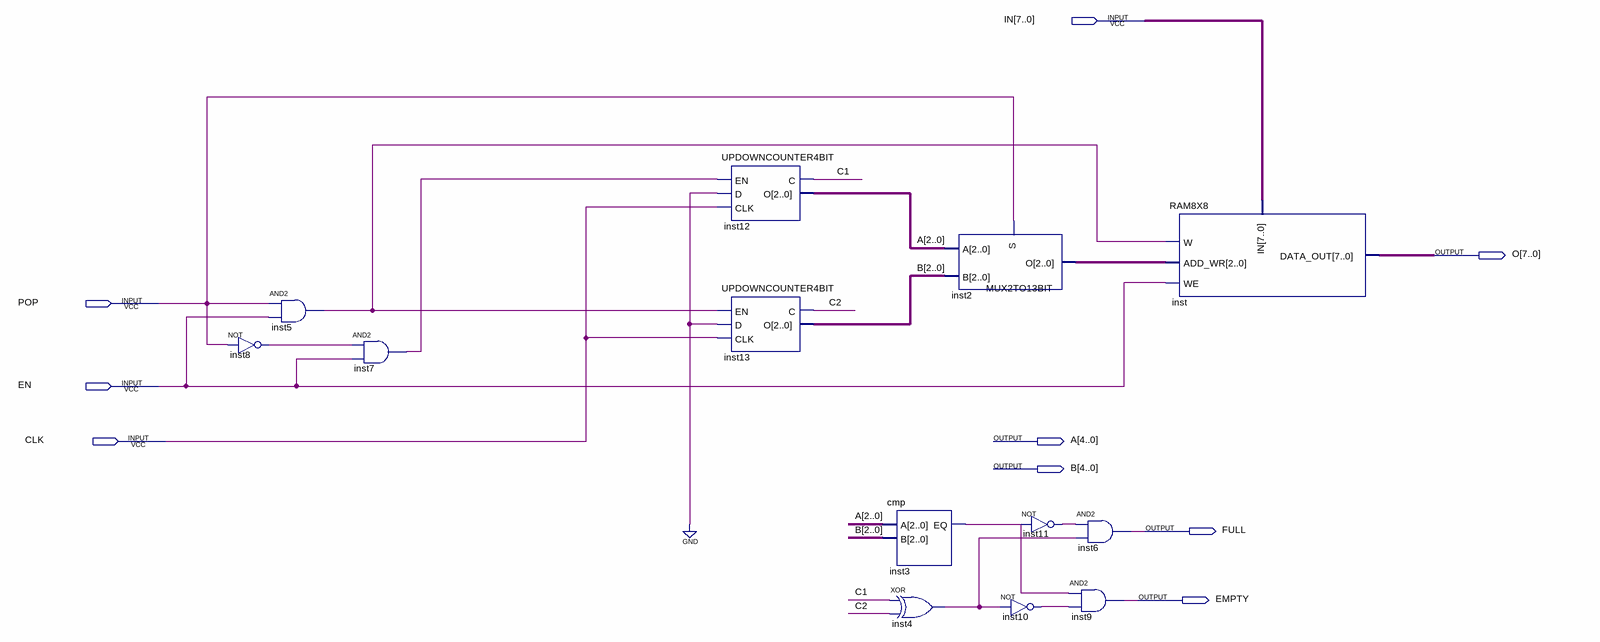
[diagram p0: schematic sheet]
// Quartus schematic QUEUERAM.bdf as structural Verilog: 13 symbols, 9 pins
module QUEUERAM (
  input  [7:0] IN,
  input  POP,
  input  EN,
  input  CLK,
  output [7:0] O,
  output [4:0] A,
  output [4:0] B,
  output FULL,
  output EMPTY
);

  wire C1, C2, inst3_eq, inst4_out, inst5_out, inst7_out, inst8_out, inst10_out, inst11_out;
  wire [2:0] inst2_o;

  not inst8 (inst8_out, POP);
  and inst5 (inst5_out, POP, EN);
  and inst7 (inst7_out, inst8_out, EN);
  UPDOWNCOUNTER4BIT inst12 (.EN(inst7_out), .D(1'b0), .CLK(CLK), .C(C1), .O(A[2:0]));
  UPDOWNCOUNTER4BIT inst13 (.EN(inst5_out), .D(1'b0), .CLK(CLK), .C(C2), .O(B[2:0]));
  cmp inst3 (.A(A[2:0]), .B(B[2:0]), .EQ(inst3_eq));
  xor inst4 (inst4_out, C1, C2);
  MUX2TO13BIT inst2 (.S(POP), .A(A[2:0]), .B(B[2:0]), .O(inst2_o));
  not inst10 (inst10_out, inst4_out);
  not inst11 (inst11_out, inst3_eq);
  and inst9 (EMPTY, inst3_eq, inst10_out);
  and inst6 (FULL, inst11_out, inst4_out);
  RAM8X8 inst (.W(inst5_out), .IN(IN), .ADD_WR(inst2_o), .WE(EN), .DATA_OUT(O));
endmodule
